# Altium schematic sheet Memory.SchDoc
size A3; SheetNumber: 5; SheetTotal: 7
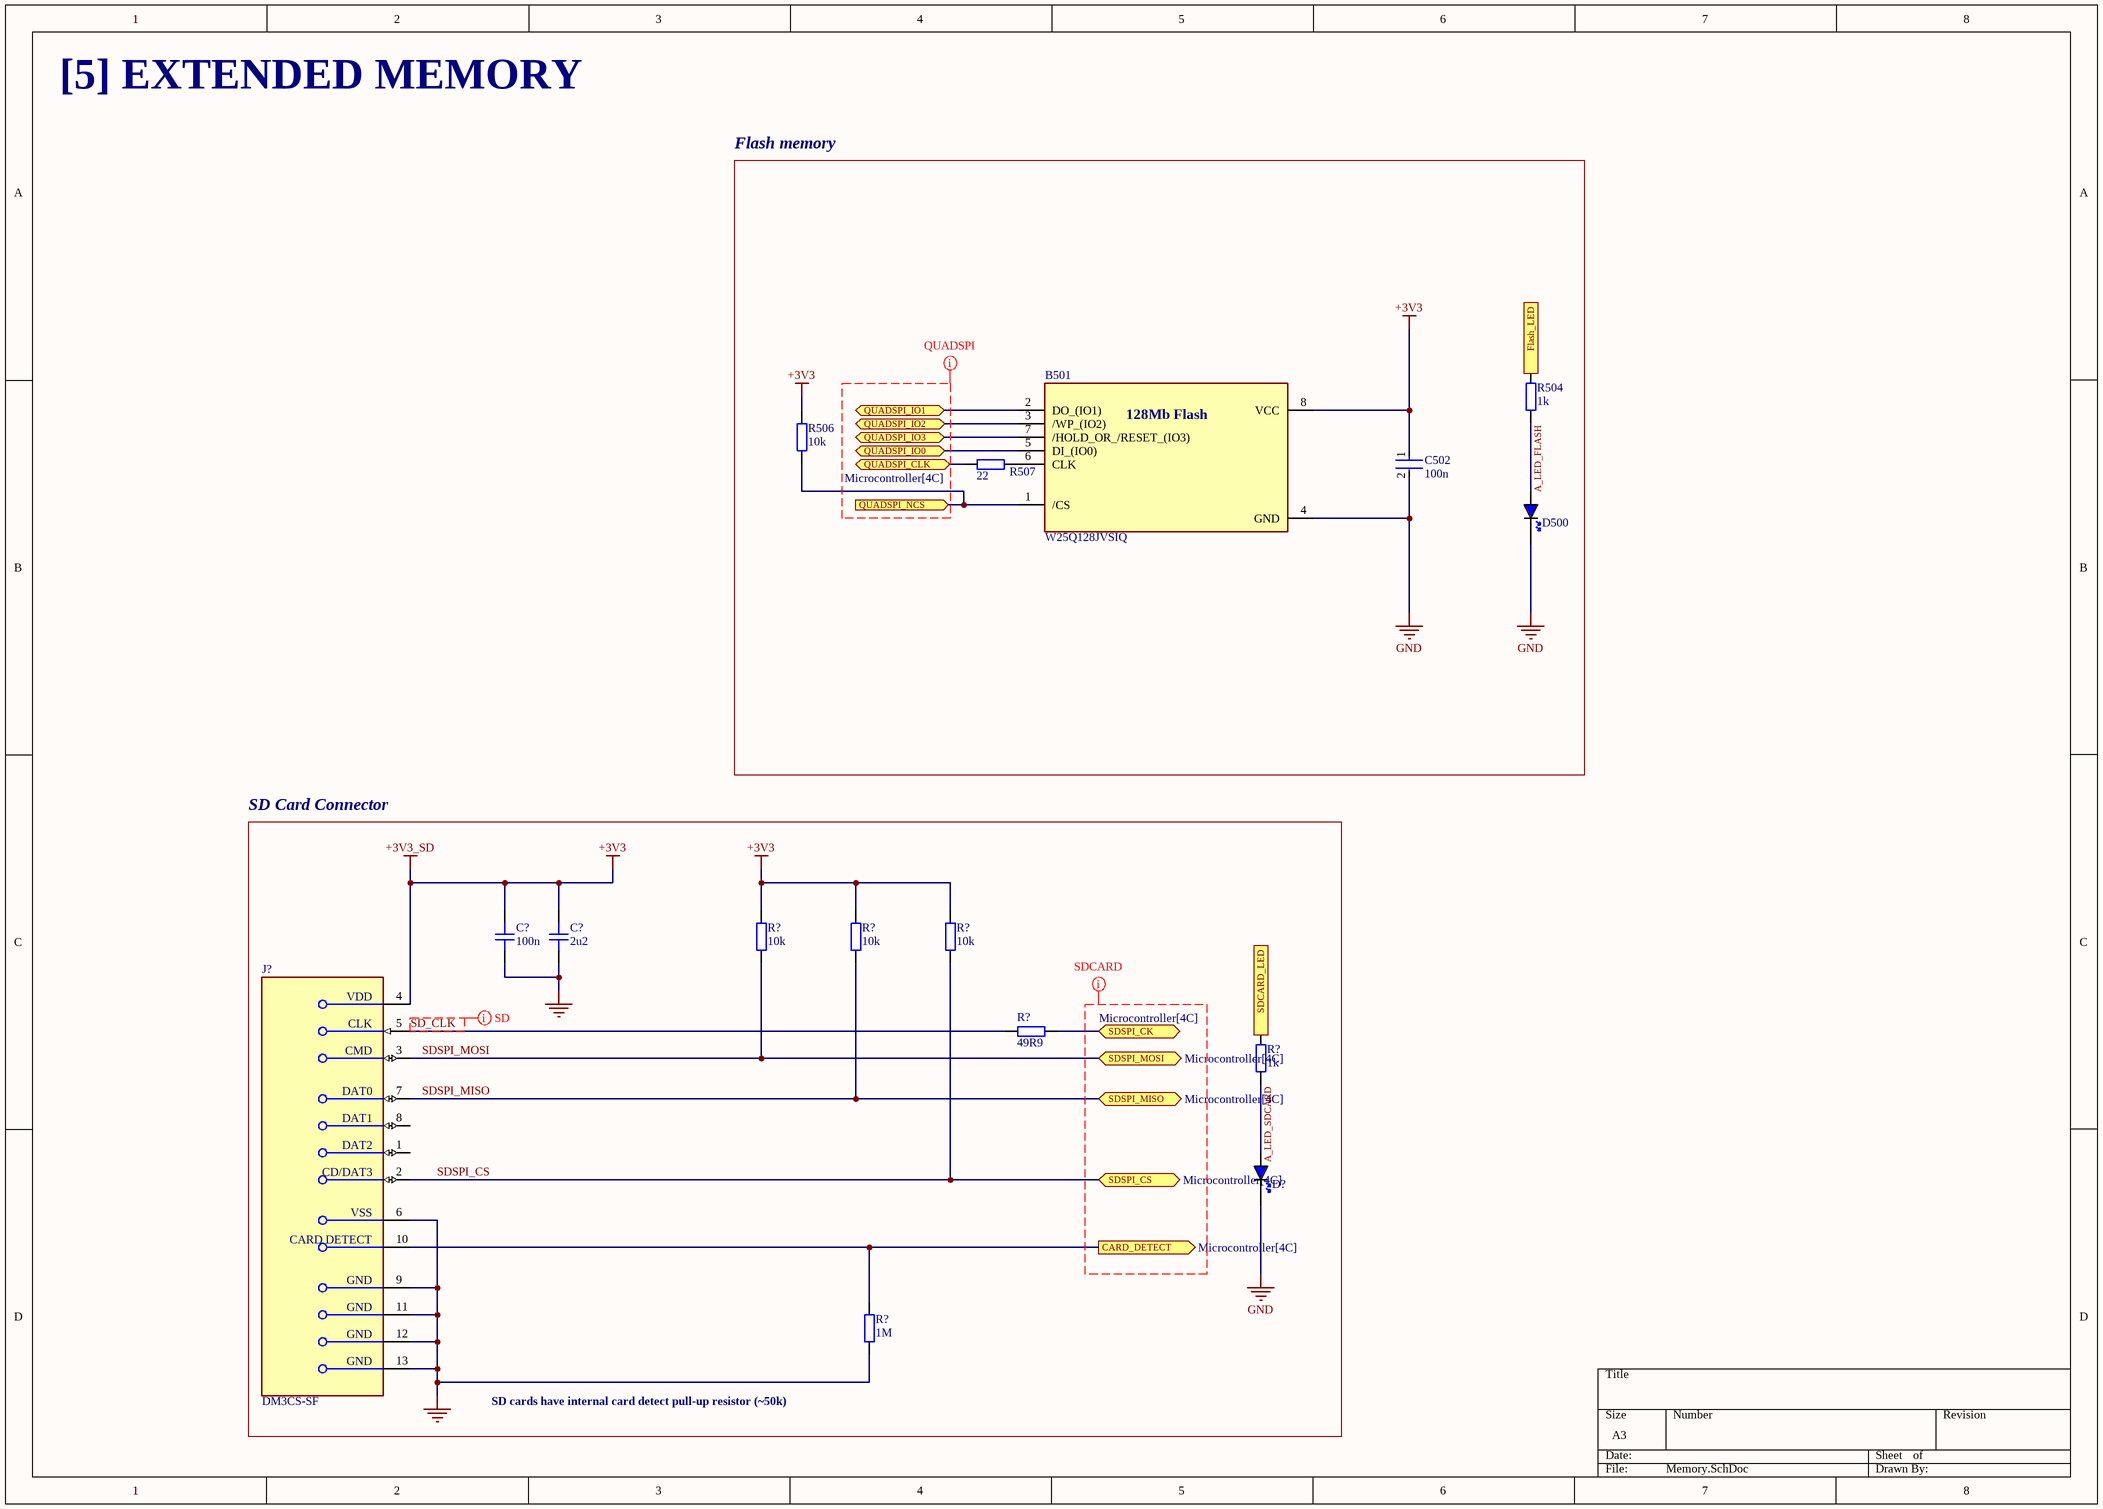
[diagram p0: Memory.SchDoc]

## Parts
(Parts that share a designator on the sheet are numbered #1, #2 ... from top to bottom, then left to right.)
B501  W25Q128JVSIQ  [SOIC127P790X216-8N]
C502  100n  [FP-CL779-IPC_C]
C?#1  100n  [CAP_0402]
C?#2  2u2  [CAP_0603]
D500  BLUE  [LED_0603_BLUE]  (value not drawn)
D?  BLUE  [LED_0603_BLUE]  (value not drawn)
J?  DM3CS-SF  [FP-DM3CS-SF-MFG]
R504  1k  [RES_0603]
R506  10k  [RES_0402]
R507  22  [RES_0402]
R?#1  10k  [RES_0402]
R?#2  10k  [RES_0402]
R?#3  10k  [RES_0402]
R?#4  49R9  [RES_0402]
R?#5  1k  [RES_0603]
R?#6  1M  [RES_0402]

## Blocks framed on the sheet
Flash memory: B501 C502 D500 R504 R506 R507
SD Card Connector: C?#1 C?#2 D? J? R?#1-R?#6

## Ports
CARD_DETECT (out, see Microcontroller[4C]), Flash_LED (in), QUADSPI_CLK (bidir, see Microcontroller[4C]), QUADSPI_IO0 (bidir, see Microcontroller[4C]), QUADSPI_IO1 (bidir, see Microcontroller[4C]), QUADSPI_IO2 (bidir, see Microcontroller[4C]), QUADSPI_IO3 (bidir, see Microcontroller[4C]), QUADSPI_NCS (in, see Microcontroller[4C]), SDCARD_LED (in), SDSPI_CK (bidir, see Microcontroller[4C]), SDSPI_CS (bidir, see Microcontroller[4C]), SDSPI_MISO (bidir, see Microcontroller[4C]), SDSPI_MOSI (bidir, see Microcontroller[4C])

## Nets
+3V3: B501.8(VCC) C502.1 C?#1.2 C?#2.2 J?.4(VDD) R506.1 R?#1.2 R?#2.2 R?#3.2  [also labelled +3V3_SD]
GND: B501.4(GND) C502.2 C?#1.1 C?#2.1 D500.K D?.K J?.6(VSS) J?.9(GND) J?.11(GND) J?.12(GND) J?.13(GND) R?#6.1
A_LED_FLASH: D500.A R504.1
A_LED_SDCARD: D?.A R?#5.1
CARD_DETECT: J?.10(CARD_DETECT) R?#6.2 ; port CARD_DETECT
QUADSPI_CLK: R507.2 ; port QUADSPI_CLK
QUADSPI_IO0: B501.5(DI_(IO0)) ; port QUADSPI_IO0
QUADSPI_IO1: B501.2(DO_(IO1)) ; port QUADSPI_IO1
QUADSPI_IO2: B501.3(/WP_(IO2)) ; port QUADSPI_IO2
QUADSPI_IO3: B501.7(/HOLD_OR_/RESET_(IO3)) ; port QUADSPI_IO3
QUADSPI_NCS: B501.1(/CS) R506.2 ; port QUADSPI_NCS
SD_CLK: J?.5(CLK) R?#4.1
SDSPI_CK: R?#4.2 ; port SDSPI_CK
SDSPI_CS: J?.2(CD/DAT3) R?#3.1 ; port SDSPI_CS
SDSPI_MISO: J?.7(DAT0) R?#2.1 ; port SDSPI_MISO
SDSPI_MOSI: J?.3(CMD) R?#1.1 ; port SDSPI_MOSI
NetB501_6: B501.6(CLK) R507.1

Not connected (* = marked no-connect by the designer): J? 1(DAT2) 8(DAT1); R504 2; R?#5 2

## Layout directives
net class QUADSPI: (no net found under the mark)
net class SD: (no net found under the mark), SD_CLK

## Notes on the sheet
- [5] EXTENDED MEMORY
- SD cards have internal card detect pull-up resistor (~50k)
- (in symbol W25Q128JVSIQ) 128Mb Flash

## Library data of the parts
B501 = W25Q128JVSIQ: 128M-bit Serial Flash Memory with uniform 4KB sectors and Dual/Quad SPI; Manufacturer_Name: Winbond; Geometry.Height: 2.16mm; Manufacturer_Part_Number: W25Q128JVSIQ; Mouser Part Number: 454-W25Q128JVSIQ; Mouser Price/Stock: https://www.mouser.co.uk/ProductDetail/Winbond/W25Q128JVSIQ?qs=qSfuJ%252Bfl%2Fd6tLXvPR4fl9w%3D%3D; Arrow Part Number: W25Q128JVSIQ; Arrow Price/Stock: https://www.arrow.com/en/products/w25q128jvsiq/winbond-electronics?region=nac; Datasheet Link: https://www.winbond.com/hq/search-resource-file.jsp?partNo=W25Q128JVSIQ&type=datasheet
C502 = CMP-13271-002336-1: Cap Ceramic 100nF 50V X7R ±10% SMD 0402 +125°C Paper T/R CL05B104KB54PNC
C?#1 = CAP_0402_16V: Capacitor SMD 0402 16V
C?#2 = CAP_0603_16V: Capacitor SMD 0603 16V
D500 D? = LED_0603_BLUE: LED 0603 BLUE SMD
J? = CMP-11597-000003-1: CONN MICRO SD CARD HINGED TYPE; Pitch: 1.1mm; Connector Type: Connector; Current Rating: 500mA; Voltage Rating (AC): 125V; Gender: Female; Insulation Resistance: 1GR; Number of Positions: 8; Contact Resistance: 100mR; Packaging: Tape and Reel; Flammability Rating: UL94 V-0; Lead Free: Lead Free; Min Operating Temperature: -25°C; Orientation: Right Angle; Width: 13.8mm; Number of Rows: 1; Housing Material: Polymer; Package Quantity: 1; Mount: Surface Mount; Max Current Rating: 500mA; Radiation Hardening: No; Max Operating Temperature: 85°C; Contact Plating: Gold; Depth: 1.83mm; Contact Material: Gold; Length: 14.1mm; Number of Contacts: 8; Termination: Solder
R504 R?#5 = RES_0603: Resistor SMD 0603; Manufacturer: *; Manufacturer Part Number: *; Distributor Link: *; LCSC: *
R506 R507 R?#1-R?#4 R?#6 = RES_0402: Resistor SMD 0402
  R506 R507: Manufacturer: *; Manufacturer Part Number: *; Distributor Link: *; LCSC: *